# Altium schematic sheet Main.SchDoc
size A; SheetNumber: 1; SheetTotal: 12
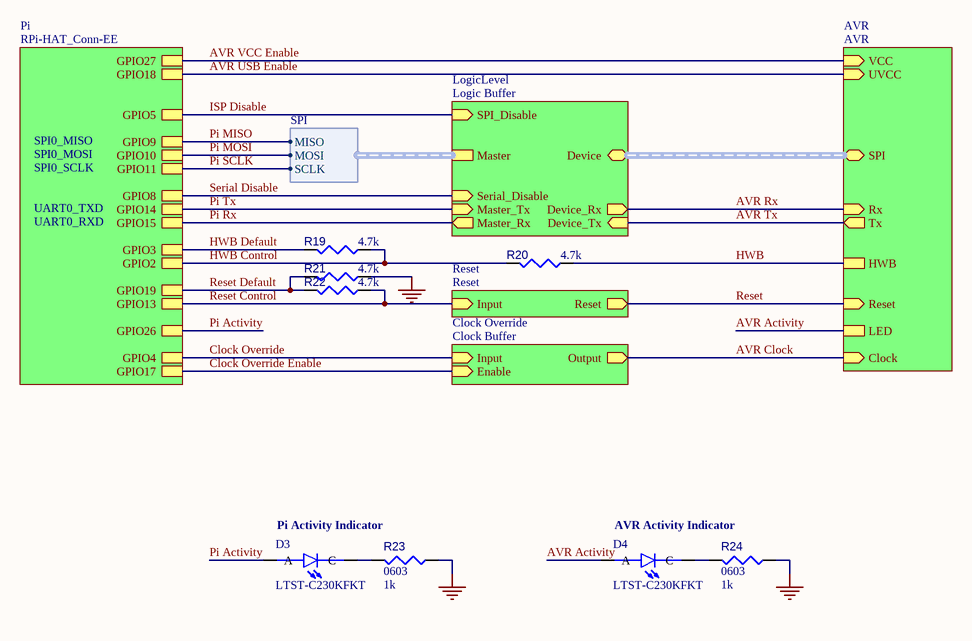
[diagram p0: Main.SchDoc]

## Parts
D3  LTST-C230KFKT  [LEDC3216X110]
D4  LTST-C230KFKT  [LEDC3216X110]
R19  value 4.7k  [RESC1608X55X25ML10T15]  (hidden comment: Resistor 1k +/-1% 0603 100 mW)
R20  value 4.7k  [RESC1608X55X25ML10T15]  (hidden comment: Resistor 1k +/-1% 0603 100 mW)
R21  value 4.7k  [RESC1608X55X25ML10T15]  (hidden comment: Resistor 1k +/-1% 0603 100 mW)
R22  value 4.7k  [RESC1608X55X25ML10T15]  (hidden comment: Resistor 1k +/-1% 0603 100 mW)
R23  value 1k  Case/Package: 0603  [RESC1608X55X25ML10T15]  (hidden comment: Resistor 1k +/-1% 0603 100 mW)
R24  value 1k  Case/Package: 0603  [RESC1608X55X25ML10T15]  (hidden comment: Resistor 1k +/-1% 0603 100 mW)

## Sub-sheets
AVR = AVR: Reset (in), SPI (bidir, harness SPI), HWB, Rx (in), Tx (out), LED, VCC (in), UVCC (in), Clock (in)
Clock Override = Clock Buffer: Enable (in), Input (in), Output (out)
LogicLevel = Logic Buffer: Device (bidir, harness SPI), Device_Tx (in), Device_Rx (out), Serial_Disable (in), Master_Rx (out), Master (harness SPI), SPI_Disable (in), Master_Tx (in)
Pi = RPi-HAT_Conn-EE: GPIO5, GPIO8, GPIO14, GPIO15, GPIO19, GPIO13, GPIO26, GPIO9, GPIO10, GPIO11, GPIO3, GPIO27, GPIO18, GPIO4, GPIO17, GPIO2
Reset = Reset: Reset (out), Input (in)

## Harnesses
SPI: MISO, MOSI, SCLK

## Nets
GND: R21.1 R23.1 R24.1
AVR Activity: D4.A ; sheet AVR/LED
AVR Clock: sheet AVR/Clock, sheet Clock Override/Output
AVR Rx: sheet AVR/Rx, sheet LogicLevel/Device_Rx
AVR Tx: sheet AVR/Tx, sheet LogicLevel/Device_Tx
AVR USB Enable: sheet Pi/GPIO18, sheet AVR/UVCC
AVR VCC Enable: sheet Pi/GPIO27, sheet AVR/VCC
Clock Override: sheet Pi/GPIO4, sheet Clock Override/Input
Clock Override Enable: sheet Pi/GPIO17, sheet Clock Override/Enable
HWB: R20.1 ; sheet AVR/HWB
HWB Control: R19.1 R20.2 ; sheet Pi/GPIO2
HWB Default: R19.2 ; sheet Pi/GPIO3
ISP Disable: sheet Pi/GPIO5, sheet LogicLevel/SPI_Disable
Pi Activity: D3.A ; sheet Pi/GPIO26
Pi MISO: sheet Pi/GPIO9, sheet LogicLevel/Master.MISO
Pi MOSI: sheet Pi/GPIO10, sheet LogicLevel/Master.MOSI
Pi Rx: sheet Pi/GPIO15, sheet LogicLevel/Master_Rx
Pi SCLK: sheet Pi/GPIO11, sheet LogicLevel/Master.SCLK
Pi Tx: sheet Pi/GPIO14, sheet LogicLevel/Master_Tx
Reset: sheet AVR/Reset, sheet Reset/Reset
Reset Control: R22.1 ; sheet Pi/GPIO13, sheet Reset/Input
Reset Default: R21.2 R22.2 ; sheet Pi/GPIO19
Serial Disable: sheet Pi/GPIO8, sheet LogicLevel/Serial_Disable
NetD3_C: D3.C R23.2
NetD4_C: D4.C R24.2

## Buses and harness runs
harness sheet AVR/SPI = sheet LogicLevel/Device

## Notes on the sheet
- SPI0_MOSI
- SPI0_MISO
- SPI0_SCLK
- UART0_TXD
- UART0_RXD
- Pi Activity Indicator
- AVR Activity Indicator

## Library data of the parts
D3 D4 = CMP-010-000000-1: Orange 605nm LED Indication - Discrete 2V 1206 (3216 Metric); MF: Lite-On Inc.; Package: 1206 Lite-On; MP: LTST-C230KFKT; Pin Count: 2; Component Type: Standard; Source: LTST-C230KFKT.SchLib; Value: *; SnapEDA_Link: https://www.snapeda.com/parts/LTST-C230KFKT/Lite-On%20Inc./view-part/353318/?ref=snap; Price: None; Availability: Unavailable; Design Item ID: LTST-C230KFKT
R19-R24 = CMP-009-00014-5: Chip Resistor, 1 KOhm, +/-1%, 0.1 W, -55 to 155 degC, 0603 (1608 Metric); Voltage Rating: 50V; Power: 100mW; Tolerance: 1%; Mounting Technology: SM; Pins: 2; Min Operating Temperature: -55°C; RoHS Compliant: True; Max Operating Temperature: 155°C
  R19-R22: Case/Package: 0603